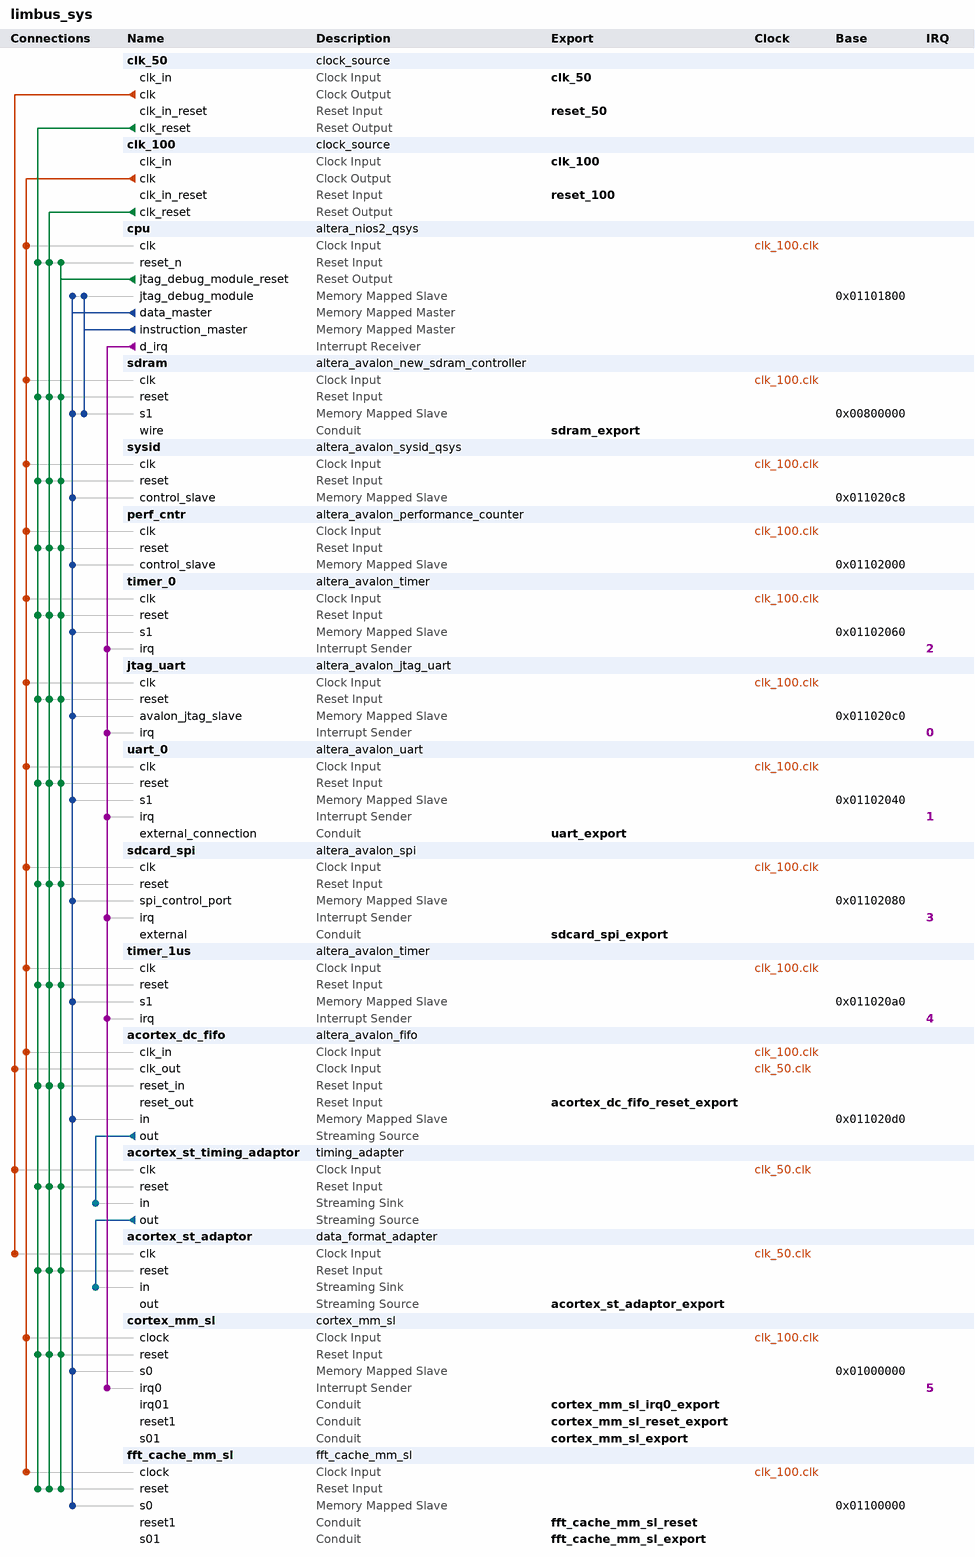
[diagram p0: system contents]
# Platform Designer (Qsys) system limbus_sys
# Parameters at their usual value, and those the tool derives, are not listed.
package require -exact qsys 11.1
create_system limbus_sys
set_project_property DEVICE_FAMILY CYCLONEII

add_instance clk_50 clock_source 11.1
set_instance_parameter_value clk_50 clockFrequency 50000000

add_instance clk_100 clock_source 11.1
set_instance_parameter_value clk_100 clockFrequency 100000000

add_instance cpu altera_nios2_qsys 11.1
set_instance_parameter_value cpu resetSlave sdram.s1
set_instance_parameter_value cpu exceptionSlave sdram.s1
set_instance_parameter_value cpu breakSlave cpu.jtag_debug_module
set_instance_parameter_value cpu impl Tiny
set_instance_parameter_value cpu icache_size 4096

add_instance sdram altera_avalon_new_sdram_controller 11.1
set_instance_parameter_value sdram TAC 5.5
set_instance_parameter_value sdram TRCD 20.0
set_instance_parameter_value sdram TRP 20.0
set_instance_parameter_value sdram casLatency 3
set_instance_parameter_value sdram columnWidth 8
set_instance_parameter_value sdram dataWidth 16
set_instance_parameter_value sdram generateSimulationModel false
set_instance_parameter_value sdram model custom
set_instance_parameter_value sdram numberOfBanks 4
set_instance_parameter_value sdram numberOfChipSelects 1
set_instance_parameter_value sdram powerUpDelay 100.0
set_instance_parameter_value sdram refreshPeriod 15.625
set_instance_parameter_value sdram rowWidth 12

add_instance sysid altera_avalon_sysid_qsys 11.1
set_instance_parameter_value sysid id 666

add_instance perf_cntr altera_avalon_performance_counter 11.1
set_instance_parameter_value perf_cntr numberOfSections 3

add_instance timer_0 altera_avalon_timer 11.1
set_instance_parameter_value timer_0 period 1
set_instance_parameter_value timer_0 periodUnits MSEC
set_instance_parameter_value timer_0 timerPreset CUSTOM

add_instance jtag_uart altera_avalon_jtag_uart 11.1
set_instance_parameter_value jtag_uart simInteractiveOptions INTERACTIVE_ASCII_OUTPUT

add_instance uart_0 altera_avalon_uart 11.1
set_instance_parameter_value uart_0 baud 115200
set_instance_parameter_value uart_0 dataBits 8
set_instance_parameter_value uart_0 fixedBaud true
set_instance_parameter_value uart_0 parity NONE
set_instance_parameter_value uart_0 stopBits 1

add_instance sdcard_spi altera_avalon_spi 11.1
set_instance_parameter_value sdcard_spi clockPolarity 0
set_instance_parameter_value sdcard_spi dataWidth 8
set_instance_parameter_value sdcard_spi masterSPI true
set_instance_parameter_value sdcard_spi numberOfSlaves 1
set_instance_parameter_value sdcard_spi targetClockRate 1000000

add_instance timer_1us altera_avalon_timer 11.1
set_instance_parameter_value timer_1us fixedPeriod true
set_instance_parameter_value timer_1us period 1
set_instance_parameter_value timer_1us periodUnits USEC
set_instance_parameter_value timer_1us timerPreset CUSTOM

add_instance acortex_dc_fifo altera_avalon_fifo 11.1
set_instance_parameter_value acortex_dc_fifo bitsPerSymbol 8
set_instance_parameter_value acortex_dc_fifo channelWidth 0
set_instance_parameter_value acortex_dc_fifo errorWidth 0
set_instance_parameter_value acortex_dc_fifo fifoDepth 128
set_instance_parameter_value acortex_dc_fifo fifoInputInterfaceOptions AVALONMM_WRITE
set_instance_parameter_value acortex_dc_fifo fifoOutputInterfaceOptions AVALONST_SOURCE
set_instance_parameter_value acortex_dc_fifo singleClockMode false
set_instance_parameter_value acortex_dc_fifo symbolsPerBeat 4
set_instance_parameter_value acortex_dc_fifo useIRQ true
set_instance_parameter_value acortex_dc_fifo usePacket false
set_instance_parameter_value acortex_dc_fifo useReadControl false
set_instance_parameter_value acortex_dc_fifo useWriteControl false

add_instance acortex_st_timing_adaptor timing_adapter 11.1
set_instance_parameter_value acortex_st_timing_adaptor inBitsPerSymbol 8
set_instance_parameter_value acortex_st_timing_adaptor inChannelWidth 0
set_instance_parameter_value acortex_st_timing_adaptor inErrorWidth 0
set_instance_parameter_value acortex_st_timing_adaptor inMaxChannel 0
set_instance_parameter_value acortex_st_timing_adaptor inReadyLatency 1
set_instance_parameter_value acortex_st_timing_adaptor inSymbolsPerBeat 4
set_instance_parameter_value acortex_st_timing_adaptor inUseEmptyPort AUTO
set_instance_parameter_value acortex_st_timing_adaptor inUsePackets false
set_instance_parameter_value acortex_st_timing_adaptor inUseReady true
set_instance_parameter_value acortex_st_timing_adaptor inUseValid true
set_instance_parameter_value acortex_st_timing_adaptor outReadyLatency 0
set_instance_parameter_value acortex_st_timing_adaptor outUseReady true
set_instance_parameter_value acortex_st_timing_adaptor outUseValid true

add_instance acortex_st_adaptor data_format_adapter 11.1
set_instance_parameter_value acortex_st_adaptor generationLanguage VERILOG
set_instance_parameter_value acortex_st_adaptor inBitsPerSymbol 8
set_instance_parameter_value acortex_st_adaptor inChannelWidth 0
set_instance_parameter_value acortex_st_adaptor inErrorWidth 0
set_instance_parameter_value acortex_st_adaptor inMaxChannel 0
set_instance_parameter_value acortex_st_adaptor inReadyLatency 0
set_instance_parameter_value acortex_st_adaptor inSymbolsPerBeat 4
set_instance_parameter_value acortex_st_adaptor inUseEmpty false
set_instance_parameter_value acortex_st_adaptor inUseEmptyPort AUTO
set_instance_parameter_value acortex_st_adaptor inUsePackets false
set_instance_parameter_value acortex_st_adaptor inUseReady true
set_instance_parameter_value acortex_st_adaptor outSymbolsPerBeat 2
set_instance_parameter_value acortex_st_adaptor outUseEmpty false
set_instance_parameter_value acortex_st_adaptor outUseEmptyPort AUTO

add_instance cortex_mm_sl cortex_mm_sl 1.0

add_instance fft_cache_mm_sl fft_cache_mm_sl 1.0

# connections
add_connection clk_50.clk acortex_dc_fifo.clk_out clock
add_connection clk_50.clk acortex_st_adaptor.clk clock
add_connection clk_50.clk acortex_st_timing_adaptor.clk clock
add_connection clk_100.clk acortex_dc_fifo.clk_in clock
add_connection clk_100.clk cortex_mm_sl.clock clock
add_connection clk_100.clk cpu.clk clock
add_connection clk_100.clk fft_cache_mm_sl.clock clock
add_connection clk_100.clk jtag_uart.clk clock
add_connection clk_100.clk perf_cntr.clk clock
add_connection clk_100.clk sdcard_spi.clk clock
add_connection clk_100.clk sdram.clk clock
add_connection clk_100.clk sysid.clk clock
add_connection clk_100.clk timer_0.clk clock
add_connection clk_100.clk timer_1us.clk clock
add_connection clk_100.clk uart_0.clk clock
add_connection clk_50.clk_reset acortex_dc_fifo.reset_in reset
add_connection clk_50.clk_reset acortex_st_adaptor.reset reset
add_connection clk_50.clk_reset acortex_st_timing_adaptor.reset reset
add_connection clk_50.clk_reset cortex_mm_sl.reset reset
add_connection clk_50.clk_reset cpu.reset_n reset
add_connection clk_50.clk_reset fft_cache_mm_sl.reset reset
add_connection clk_50.clk_reset jtag_uart.reset reset
add_connection clk_50.clk_reset perf_cntr.reset reset
add_connection clk_50.clk_reset sdcard_spi.reset reset
add_connection clk_50.clk_reset sdram.reset reset
add_connection clk_50.clk_reset sysid.reset reset
add_connection clk_50.clk_reset timer_0.reset reset
add_connection clk_50.clk_reset timer_1us.reset reset
add_connection clk_50.clk_reset uart_0.reset reset
add_connection clk_100.clk_reset acortex_dc_fifo.reset_in reset
add_connection clk_100.clk_reset acortex_st_adaptor.reset reset
add_connection clk_100.clk_reset acortex_st_timing_adaptor.reset reset
add_connection clk_100.clk_reset cortex_mm_sl.reset reset
add_connection clk_100.clk_reset cpu.reset_n reset
add_connection clk_100.clk_reset fft_cache_mm_sl.reset reset
add_connection clk_100.clk_reset jtag_uart.reset reset
add_connection clk_100.clk_reset perf_cntr.reset reset
add_connection clk_100.clk_reset sdcard_spi.reset reset
add_connection clk_100.clk_reset sdram.reset reset
add_connection clk_100.clk_reset sysid.reset reset
add_connection clk_100.clk_reset timer_0.reset reset
add_connection clk_100.clk_reset timer_1us.reset reset
add_connection clk_100.clk_reset uart_0.reset reset
add_connection cpu.jtag_debug_module_reset acortex_dc_fifo.reset_in reset
add_connection cpu.jtag_debug_module_reset acortex_st_adaptor.reset reset
add_connection cpu.jtag_debug_module_reset acortex_st_timing_adaptor.reset reset
add_connection cpu.jtag_debug_module_reset cortex_mm_sl.reset reset
add_connection cpu.jtag_debug_module_reset cpu.reset_n reset
add_connection cpu.jtag_debug_module_reset fft_cache_mm_sl.reset reset
add_connection cpu.jtag_debug_module_reset jtag_uart.reset reset
add_connection cpu.jtag_debug_module_reset perf_cntr.reset reset
add_connection cpu.jtag_debug_module_reset sdcard_spi.reset reset
add_connection cpu.jtag_debug_module_reset sdram.reset reset
add_connection cpu.jtag_debug_module_reset sysid.reset reset
add_connection cpu.jtag_debug_module_reset timer_0.reset reset
add_connection cpu.jtag_debug_module_reset timer_1us.reset reset
add_connection cpu.jtag_debug_module_reset uart_0.reset reset
add_connection cpu.data_master acortex_dc_fifo.in avalon
set_connection_parameter_value cpu.data_master/acortex_dc_fifo.in baseAddress 0x011020d0
add_connection cpu.data_master cortex_mm_sl.s0 avalon
set_connection_parameter_value cpu.data_master/cortex_mm_sl.s0 baseAddress 0x01000000
add_connection cpu.data_master cpu.jtag_debug_module avalon
set_connection_parameter_value cpu.data_master/cpu.jtag_debug_module baseAddress 0x01101800
add_connection cpu.data_master fft_cache_mm_sl.s0 avalon
set_connection_parameter_value cpu.data_master/fft_cache_mm_sl.s0 baseAddress 0x01100000
add_connection cpu.data_master jtag_uart.avalon_jtag_slave avalon
set_connection_parameter_value cpu.data_master/jtag_uart.avalon_jtag_slave baseAddress 0x011020c0
add_connection cpu.data_master perf_cntr.control_slave avalon
set_connection_parameter_value cpu.data_master/perf_cntr.control_slave baseAddress 0x01102000
add_connection cpu.data_master sdcard_spi.spi_control_port avalon
set_connection_parameter_value cpu.data_master/sdcard_spi.spi_control_port baseAddress 0x01102080
add_connection cpu.data_master sdram.s1 avalon
set_connection_parameter_value cpu.data_master/sdram.s1 baseAddress 0x00800000
add_connection cpu.data_master sysid.control_slave avalon
set_connection_parameter_value cpu.data_master/sysid.control_slave baseAddress 0x011020c8
add_connection cpu.data_master timer_0.s1 avalon
set_connection_parameter_value cpu.data_master/timer_0.s1 baseAddress 0x01102060
add_connection cpu.data_master timer_1us.s1 avalon
set_connection_parameter_value cpu.data_master/timer_1us.s1 baseAddress 0x011020a0
add_connection cpu.data_master uart_0.s1 avalon
set_connection_parameter_value cpu.data_master/uart_0.s1 baseAddress 0x01102040
add_connection cpu.instruction_master cpu.jtag_debug_module avalon
set_connection_parameter_value cpu.instruction_master/cpu.jtag_debug_module baseAddress 0x01101800
add_connection cpu.instruction_master sdram.s1 avalon
set_connection_parameter_value cpu.instruction_master/sdram.s1 baseAddress 0x00800000
add_connection acortex_dc_fifo.out acortex_st_timing_adaptor.in avalon_streaming
add_connection acortex_st_timing_adaptor.out acortex_st_adaptor.in avalon_streaming
add_connection cpu.d_irq cortex_mm_sl.irq0 interrupt
set_connection_parameter_value cpu.d_irq/cortex_mm_sl.irq0 irqNumber 5
add_connection cpu.d_irq jtag_uart.irq interrupt
set_connection_parameter_value cpu.d_irq/jtag_uart.irq irqNumber 0
add_connection cpu.d_irq sdcard_spi.irq interrupt
set_connection_parameter_value cpu.d_irq/sdcard_spi.irq irqNumber 3
add_connection cpu.d_irq timer_0.irq interrupt
set_connection_parameter_value cpu.d_irq/timer_0.irq irqNumber 2
add_connection cpu.d_irq timer_1us.irq interrupt
set_connection_parameter_value cpu.d_irq/timer_1us.irq irqNumber 4
add_connection cpu.d_irq uart_0.irq interrupt
set_connection_parameter_value cpu.d_irq/uart_0.irq irqNumber 1

# exported interfaces
add_interface clk_50 clock sink
set_interface_property clk_50 EXPORT_OF clk_50.clk_in
add_interface reset_50 reset sink
set_interface_property reset_50 EXPORT_OF clk_50.clk_in_reset
add_interface clk_100 clock sink
set_interface_property clk_100 EXPORT_OF clk_100.clk_in
add_interface reset_100 reset sink
set_interface_property reset_100 EXPORT_OF clk_100.clk_in_reset
add_interface sdram_export conduit end
set_interface_property sdram_export EXPORT_OF sdram.wire
add_interface uart_export conduit end
set_interface_property uart_export EXPORT_OF uart_0.external_connection
add_interface sdcard_spi_export conduit end
set_interface_property sdcard_spi_export EXPORT_OF sdcard_spi.external
add_interface acortex_dc_fifo_reset_export reset sink
set_interface_property acortex_dc_fifo_reset_export EXPORT_OF acortex_dc_fifo.reset_out
add_interface acortex_st_adaptor_export avalon_streaming source
set_interface_property acortex_st_adaptor_export EXPORT_OF acortex_st_adaptor.out
add_interface cortex_mm_sl_export conduit end
set_interface_property cortex_mm_sl_export EXPORT_OF cortex_mm_sl.s01
add_interface cortex_mm_sl_reset_export conduit end
set_interface_property cortex_mm_sl_reset_export EXPORT_OF cortex_mm_sl.reset1
add_interface cortex_mm_sl_irq0_export conduit end
set_interface_property cortex_mm_sl_irq0_export EXPORT_OF cortex_mm_sl.irq01
add_interface fft_cache_mm_sl_export conduit end
set_interface_property fft_cache_mm_sl_export EXPORT_OF fft_cache_mm_sl.s01
add_interface fft_cache_mm_sl_reset conduit end
set_interface_property fft_cache_mm_sl_reset EXPORT_OF fft_cache_mm_sl.reset1

save_system limbus_sys.qsys
